# EAGLE design SC01 ProtoBoard V0.1 (EAGLE 9.6.2)

## Sheet 1 of 2
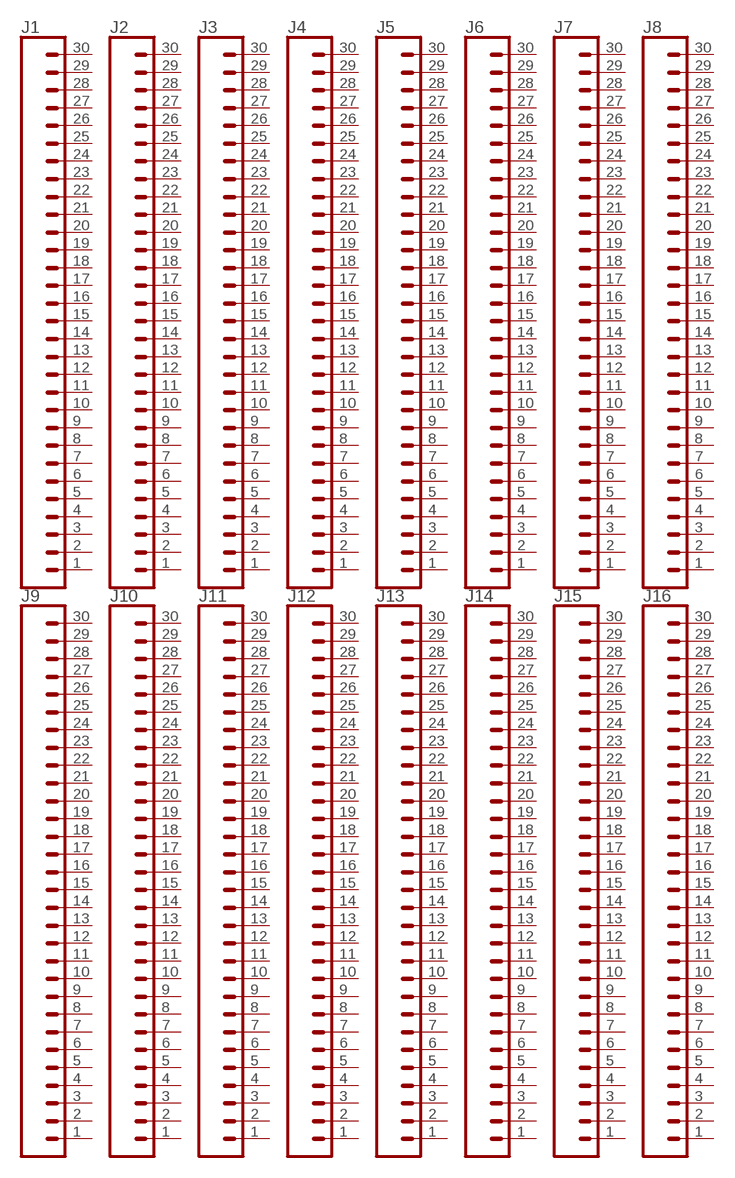
[diagram p0: schematic, sheet 1]

### Parts
J1  CONN_30NO_SILK  [1X30_NO_SILK]
J2  CONN_30NO_SILK  [1X30_NO_SILK]
J3  CONN_30NO_SILK  [1X30_NO_SILK]
J4  CONN_30NO_SILK  [1X30_NO_SILK]
J5  CONN_30NO_SILK  [1X30_NO_SILK]
J6  CONN_30NO_SILK  [1X30_NO_SILK]
J7  CONN_30NO_SILK  [1X30_NO_SILK]
J8  CONN_30NO_SILK  [1X30_NO_SILK]
J9  CONN_30NO_SILK  [1X30_NO_SILK]
J10  CONN_30NO_SILK  [1X30_NO_SILK]
J11  CONN_30NO_SILK  [1X30_NO_SILK]
J12  CONN_30NO_SILK  [1X30_NO_SILK]
J13  CONN_30NO_SILK  [1X30_NO_SILK]
J14  CONN_30NO_SILK  [1X30_NO_SILK]
J15  CONN_30NO_SILK  [1X30_NO_SILK]
J16  CONN_30NO_SILK  [1X30_NO_SILK]
Unconnected: J1.1 J1.2 J1.3 J1.4 J1.5 J1.6 J1.7 J1.8 J1.9 J1.10 J1.11 J1.12 J1.13 J1.14 J1.15 J1.16 J1.17 J1.18 J1.19 J1.20 J1.21 J1.22 J1.23 J1.24 J1.25 J1.26 J1.27 J1.28 J1.29 J1.30 J2.1 J2.2 J2.3 J2.4 J2.5 J2.6 J2.7 J2.8 J2.9 J2.10 J2.11 J2.12 J2.13 J2.14 J2.15 J2.16 J2.17 J2.18 J2.19 J2.20 J2.21 J2.22 J2.23 J2.24 J2.25 J2.26 J2.27 J2.28 J2.29 J2.30 J3.1 J3.2 J3.3 J3.4 J3.5 J3.6 J3.7 J3.8 J3.9 J3.10 J3.11 J3.12 J3.13 J3.14 J3.15 J3.16 J3.17 J3.18 J3.19 J3.20 J3.21 J3.22 J3.23 J3.24 J3.25 J3.26 J3.27 J3.28 J3.29 J3.30 J4.1 J4.2 J4.3 J4.4 J4.5 J4.6 J4.7 J4.8 J4.9 J4.10 J4.11 J4.12 J4.13 J4.14 J4.15 J4.16 J4.17 J4.18 J4.19 J4.20 J4.21 J4.22 J4.23 J4.24 J4.25 J4.26 J4.27 J4.28 J4.29 J4.30 J5.1 J5.2 J5.3 J5.4 J5.5 J5.6 J5.7 J5.8 J5.9 J5.10 J5.11 J5.12 J5.13 J5.14 J5.15 J5.16 J5.17 J5.18 J5.19 J5.20 J5.21 J5.22 J5.23 J5.24 J5.25 J5.26 J5.27 J5.28 J5.29 J5.30 J6.1 J6.2 J6.3 J6.4 J6.5 J6.6 J6.7 J6.8 J6.9 J6.10 J6.11 J6.12 J6.13 J6.14 J6.15 J6.16 J6.17 J6.18 J6.19 J6.20 J6.21 J6.22 J6.23 J6.24 J6.25 J6.26 J6.27 J6.28 J6.29 J6.30 J7.1 J7.2 J7.3 J7.4 J7.5 J7.6 J7.7 J7.8 J7.9 J7.10 J7.11 J7.12 J7.13 J7.14 J7.15 J7.16 J7.17 J7.18 J7.19 J7.20 J7.21 J7.22 J7.23 J7.24 J7.25 J7.26 J7.27 J7.28 J7.29 J7.30 J8.1 J8.2 J8.3 J8.4 J8.5 J8.6 J8.7 J8.8 J8.9 J8.10 J8.11 J8.12 J8.13 J8.14 J8.15 J8.16 J8.17 J8.18 J8.19 J8.20 J8.21 J8.22 J8.23 J8.24 J8.25 J8.26 J8.27 J8.28 J8.29 J8.30 J9.1 J9.2 J9.3 J9.4 J9.5 J9.6 J9.7 J9.8 J9.9 J9.10 J9.11 J9.12 J9.13 J9.14 J9.15 J9.16 J9.17 J9.18 J9.19 J9.20 J9.21 J9.22 J9.23 J9.24 J9.25 J9.26 J9.27 J9.28 J9.29 J9.30 J10.1 J10.2 J10.3 J10.4 J10.5 J10.6 J10.7 J10.8 J10.9 J10.10 J10.11 J10.12 J10.13 J10.14 J10.15 J10.16 J10.17 J10.18 J10.19 J10.20 J10.21 J10.22 J10.23 J10.24 J10.25 J10.26 J10.27 J10.28 J10.29 J10.30 J11.1 J11.2 J11.3 J11.4 J11.5 J11.6 J11.7 J11.8 J11.9 J11.10 J11.11 J11.12 J11.13 J11.14 J11.15 J11.16 J11.17 J11.18 J11.19 J11.20 J11.21 J11.22 J11.23 J11.24 J11.25 J11.26 J11.27 J11.28 J11.29 J11.30 J12.1 J12.2 J12.3 J12.4 J12.5 J12.6 J12.7 J12.8 J12.9 J12.10 J12.11 J12.12 J12.13 J12.14 J12.15 J12.16 J12.17 J12.18 J12.19 J12.20 J12.21 J12.22 J12.23 J12.24 J12.25 J12.26 J12.27 J12.28 J12.29 J12.30 J13.1 J13.2 J13.3 J13.4 J13.5 J13.6 J13.7 J13.8 J13.9 J13.10 J13.11 J13.12 J13.13 J13.14 J13.15 J13.16 J13.17 J13.18 J13.19 J13.20 J13.21 J13.22 J13.23 J13.24 J13.25 J13.26 J13.27 J13.28 J13.29 J13.30 J14.1 J14.2 J14.3 J14.4 J14.5 J14.6 J14.7 J14.8 J14.9 J14.10 J14.11 J14.12 J14.13 J14.14 J14.15 J14.16 J14.17 J14.18 J14.19 J14.20 J14.21 J14.22 J14.23 J14.24 J14.25 J14.26 J14.27 J14.28 J14.29 J14.30 J15.1 J15.2 J15.3 J15.4 J15.5 J15.6 J15.7 J15.8 J15.9 J15.10 J15.11 J15.12 J15.13 J15.14 J15.15 J15.16 J15.17 J15.18 J15.19 J15.20 J15.21 J15.22 J15.23 J15.24 J15.25 J15.26 J15.27 J15.28 J15.29 J15.30 J16.1 J16.2 J16.3 J16.4 J16.5 J16.6 J16.7 J16.8 J16.9 J16.10 J16.11 J16.12 J16.13 J16.14 J16.15 J16.16 J16.17 J16.18 J16.19 J16.20 J16.21 J16.22 J16.23 J16.24 J16.25 J16.26 J16.27 J16.28 J16.29 J16.30

## Sheet 2 of 2
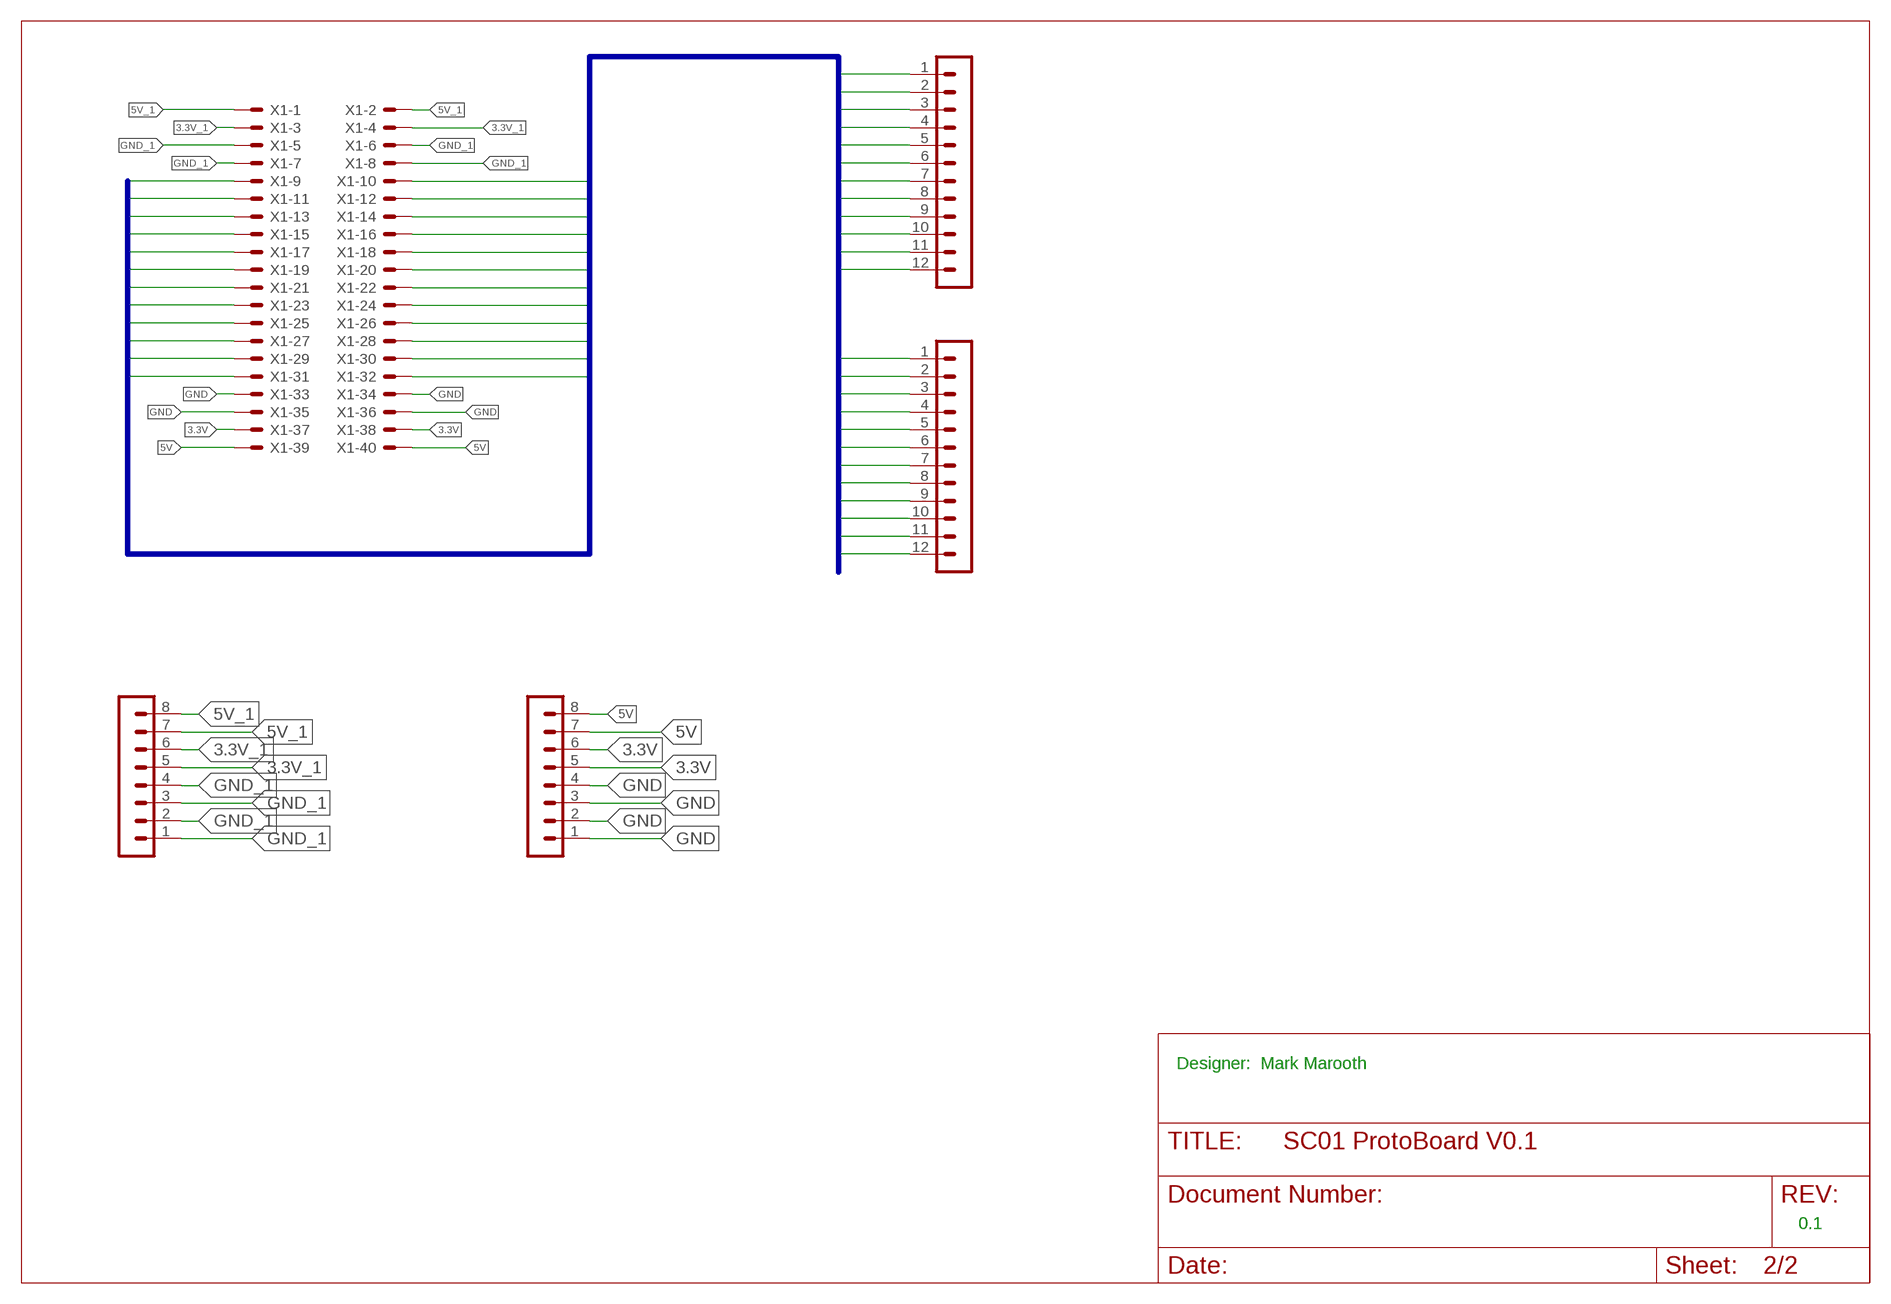
[diagram p1: schematic, sheet 2]

### Parts
HDR1  MA12-1  [MA12-1]
HDR2  MA12-1  [MA12-1]
HDR3  MA08-1  [MA08-1]
HDR4  MA08-1  [MA08-1]
X1  87758-4016  [87758-4016]

### Nets
3.3V: HDR4.5 HDR4.6 X1.37 X1.38
3.3V_1: HDR3.5 HDR3.6 X1.3 X1.4
5V: HDR4.7 HDR4.8 X1.39 X1.40
5V_1: HDR3.7 HDR3.8 X1.1 X1.2
GND: HDR4.1 HDR4.2 HDR4.3 HDR4.4 X1.33 X1.34 X1.35 X1.36
GND_1: HDR3.1 HDR3.2 HDR3.3 HDR3.4 X1.5 X1.6 X1.7 X1.8
PHEADER9: HDR1.1 X1.9
PHEADER10: HDR1.2 X1.10
PHEADER11: HDR1.3 X1.11
PHEADER12: HDR1.4 X1.12
PHEADER13: HDR1.5 X1.13
PHEADER14: HDR1.6 X1.14
PHEADER15: HDR1.7 X1.15
PHEADER16: HDR1.8 X1.16
PHEADER17: HDR1.9 X1.17
PHEADER18: HDR1.10 X1.18
PHEADER19: HDR1.11 X1.19
PHEADER20: HDR1.12 X1.20
PHEADER21: HDR2.1 X1.21
PHEADER22: HDR2.2 X1.22
PHEADER23: HDR2.3 X1.23
PHEADER24: HDR2.4 X1.24
PHEADER25: HDR2.5 X1.25
PHEADER26: HDR2.6 X1.26
PHEADER27: HDR2.7 X1.27
PHEADER28: HDR2.8 X1.28
PHEADER29: HDR2.9 X1.29
PHEADER30: HDR2.10 X1.30
PHEADER31: HDR2.11 X1.31
PHEADER32: HDR2.12 X1.32

### Buses
PHEADER[1..40]

### Notes on the sheet
- Designer:  Mark Marooth
- 0.1

## Library data of the parts
HDR1 HDR2 = con-lstb:MA12-1: PIN HEADER; OC_FARNELL: unknown; OC_NEWARK: unknown
HDR3 HDR4 = con-lstb:MA08-1: PIN HEADER; OC_FARNELL: unknown; OC_NEWARK: unknown
J1-J16 = SparkFun-Connectors:CONN_30: Multi connection point. Often used as Generic Header-pin footprint for 0.1 inch spaced/style header connections On any of the 0.1 inch spaced packages, you can populate with these: Break Away Headers - Straight <https://www.sparkfun.com/products/116> (PRT-00116) Break Away Male Headers - Right Angle <https://www.sparkfun.com/products/553> (PRT-00553) Female Headers <https://www.sparkfun.com/products/115> (PRT-00115) Break Away Headers - Machine Pin <https://www.sparkfun.com/products/117> (PRT-00117) Break Away Female Headers - Swiss Machine Pin <https://www.sparkfun.com/products/743> (PRT-00743) For SCREWTERMINALS and SPRING TERMINALS visit here: Screw Terimnals on SparkFun.com <https://www.sparkfun.com/search/results?term=Screw+Terminals> (5mm/3.5mm/2.54mm spacing) This device is also useful as a general connection point to wire up your design to another part of your project. Our various solder wires solder well into these plated through hole pads. Hook-Up Wire - Assortment (Stranded, 22 AWG) <https://www.sparkfun.com/products/11375> (PRT-11375) Hook-Up Wire - Assortment (Solid Core, 22 AWG) <https://www.sparkfun.com/products/11367> (PRT-11367) View the entire wire category on our website here <https://www.sparkfun.com/categories/141> Special notes: Molex polarized connector foot print use with SKU : PRT-08231 with associated crimp pins and housings. 1MM SMD Version SKU: PRT-10208 NOTES ON THE VARIANTS LOCK and LOCK_LONGPADS... This footprint was designed to help hold the alignment of a through-hole component (i.e. 6-pin header) while soldering it into place. You may notice that each hole has been shifted either up or down by 0.005 of an inch from it's more standard position (which is a perfectly straight line). This slight alteration caused the pins (the squares in the middle) to touch the edges of the holes. Because they are alternating, it causes a "brace" to hold the component in place. 0.005 has proven to be the perfect amount of "off-center" position when using our standard breakaway headers. Although looks a little odd when you look at the bare footprint, once you have a header in there, the alteration is very hard to notice. Also,if you push a header all the way into place, it is covered up entirely on the bottom side.
X1 = con-molex:87758-4016: 40 Pin - 2mm Dual Row Single Wafer, Vertical T/H HDR Source: http://www.molex.com/pdm_docs/sd/877580616_sd.pdf; MPN: 87758-4016; OC_FARNELL: unknown; OC_NEWARK: 25M5691

## Board
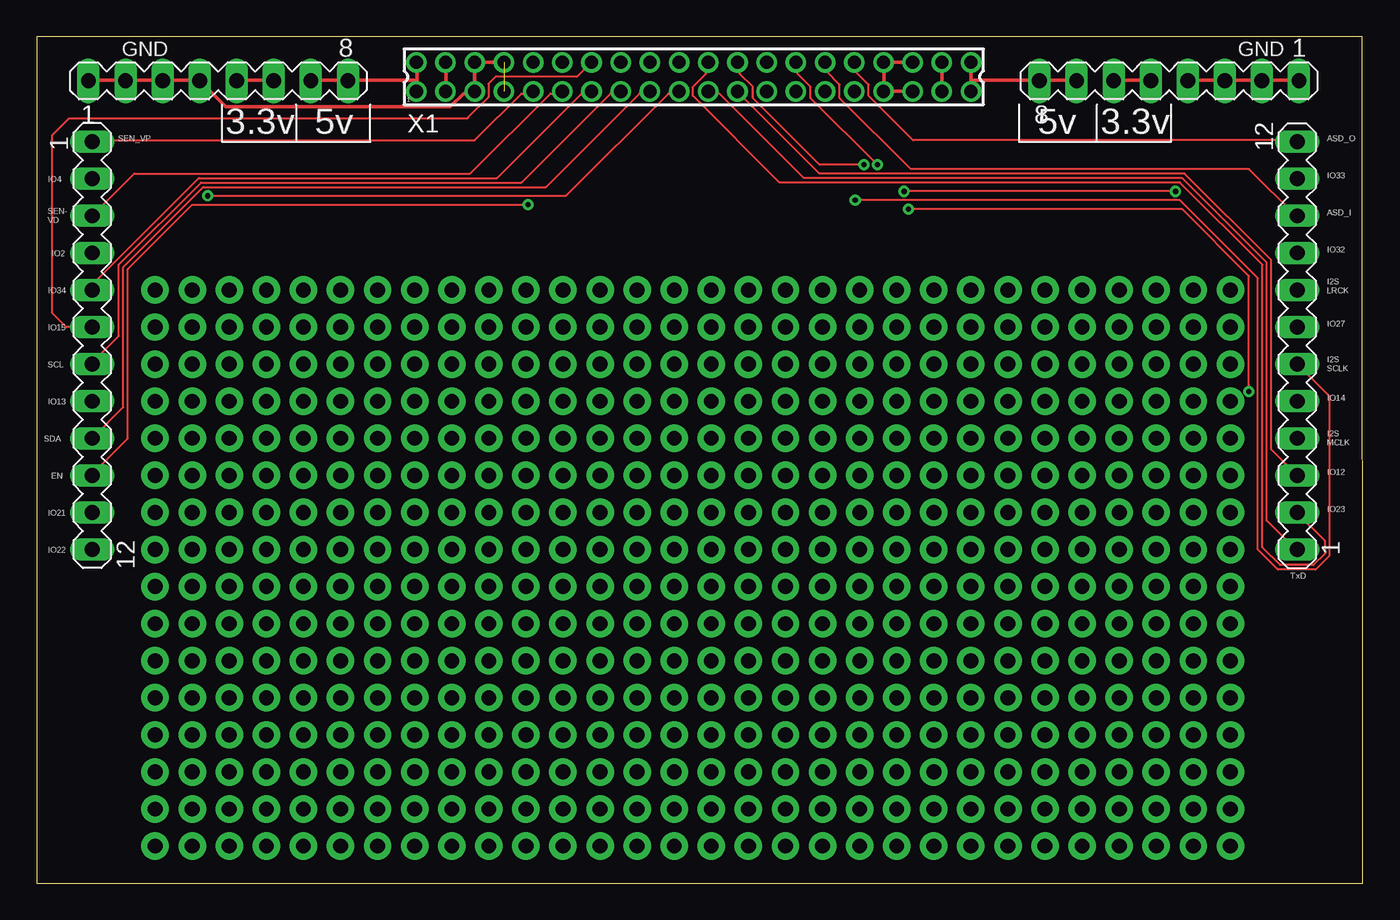
[diagram p2: board, top side]
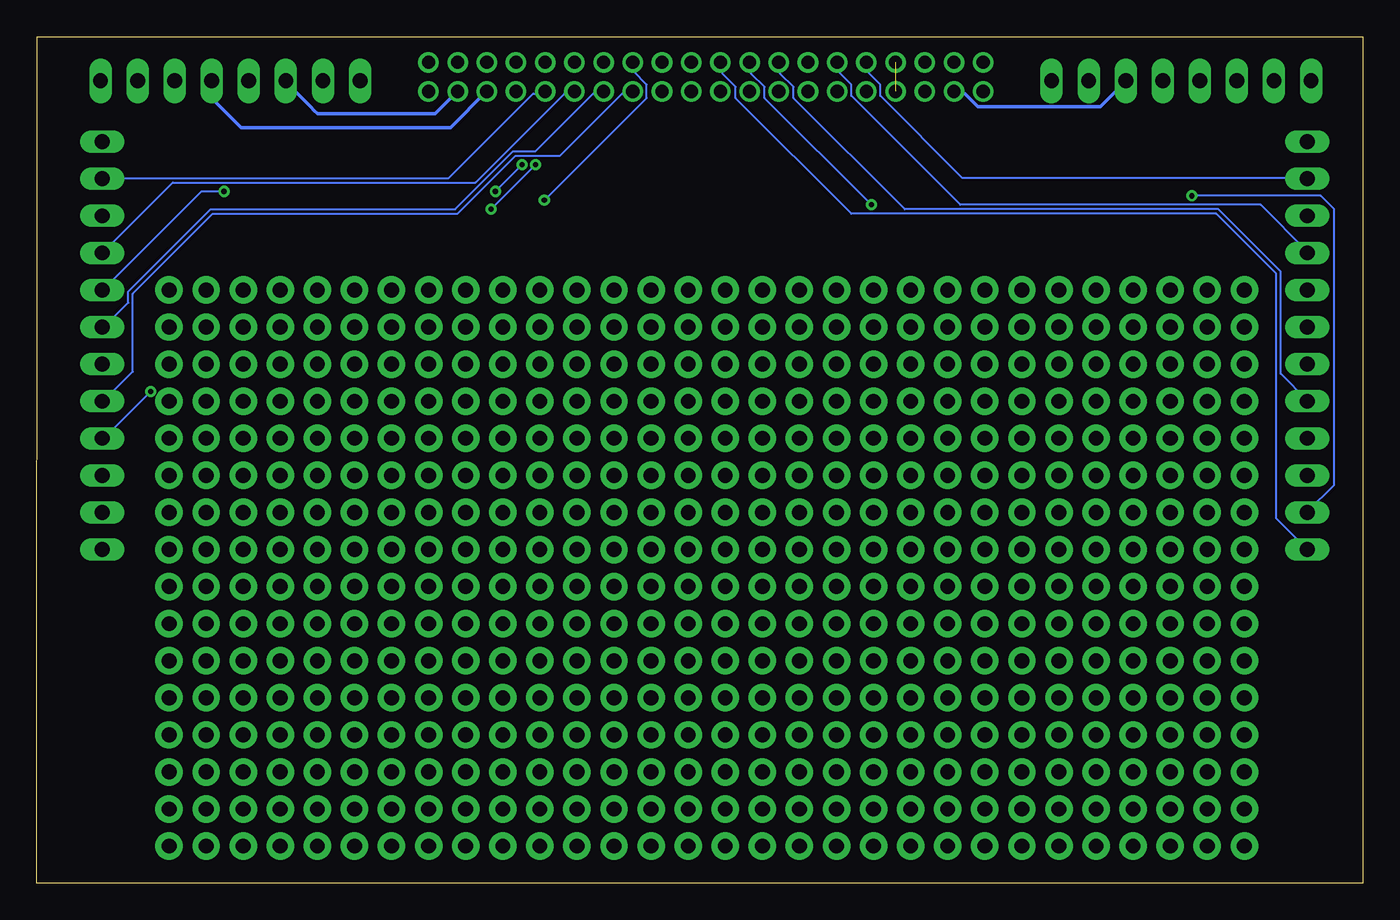
[diagram p3: board, bottom side, seen from below]

Size 90.87 x 58.01 mm. Coordinates in mm from the lower left corner, seen from the top.
Outline: 0,0 90.87,0 90.81,58.01 0,58.01 0,0
Copper layers (1*16): Top 0.035mm / dielectric 1.5mm / Bottom 0.035mm
Design rules "default": minimum track width 6mil, minimum drill 0.35mm, track to track 6mil, track to pad 6mil, pad to pad 6mil, via to via 6mil, smd to smd 6mil, copper to edge 40mil, drill to drill 6mil, minimum pad ring 10mil, minimum via ring 8mil, stop-mask expansion 4mil, vias tented up to drill 0mil, thermal gap 10mil

### Footprints (pad centres in the part's own frame; a part is rotated, then mirrored left to right if it is on the bottom)
MA12-1 = drill 1.016 long: 1 -13.97,0; 2 -11.43,0; 3 -8.89,0; 4 -6.35,0; 5 -3.81,0; 6 -1.27,0; 7 1.27,0; 8 3.81,0; 9 6.35,0; 10 8.89,0; 11 11.43,0; 12 13.97,0
MA08-1 = drill 1.016 long: 1 -8.89,0; 2 -6.35,0; 3 -3.81,0; 4 -1.27,0; 5 1.27,0; 6 3.81,0; 7 6.35,0; 8 8.89,0
1X30_NO_SILK = drill 1.016 pad 1.88: 1 0,0; 2 2.54,0; 3 5.08,0; 4 7.62,0; 5 10.16,0; 6 12.7,0; 7 15.24,0; 8 17.78,0; 9 20.32,0; 10 22.86,0; 11 25.4,0; 12 27.94,0; 13 30.48,0; 14 33.02,0; 15 35.56,0; 16 38.1,0; 17 40.64,0; 18 43.18,0; 19 45.72,0; 20 48.26,0; 21 50.8,0; 22 53.34,0; 23 55.88,0; 24 58.42,0; 25 60.96,0; 26 63.5,0; 27 66.04,0; 28 68.58,0; 29 71.12,0; 30 73.66,0
87758-4016 = drill 0.9 pad 1.27: 1 -19,-1; 2 -19,1; 3 -17,-1; 4 -17,1; 5 -15,-1; 6 -15,1; 7 -13,-1; 8 -13,1; 9 -11,-1; 10 -11,1; 11 -9,-1; 12 -9,1; 13 -7,-1; 14 -7,1; 15 -5,-1; 16 -5,1; 17 -3,-1; 18 -3,1; 19 -1,-1; 20 -1,1; 21 1,-1; 22 1,1; 23 3,-1; 24 3,1; 25 5,-1; 26 5,1; 27 7,-1; 28 7,1; 29 9,-1; 30 9,1; 31 11,-1; 32 11,1; 33 13,-1; 34 13,1; 35 15,-1; 36 15,1; 37 17,-1; 38 17,1; 39 19,-1; 40 19,1

### Placement (x,y rotation side)
HDR1  3.81,36.83 270 top
HDR2  86.36,36.83 90 top
HDR3  12.45,54.97 0 top
HDR4  77.6,54.97 180 top
J1  8.13,40.64 0 top
J2  8.13,38.1 0 top
J3  8.13,35.56 0 top
J4  8.13,33.02 0 top
J5  8.13,30.48 0 top
J6  8.13,27.94 0 top
J7  8.13,25.4 0 top
J8  8.13,22.86 0 top
J9  8.13,20.32 0 top
J10  8.13,17.78 0 top
J11  8.13,15.24 0 top
J12  8.13,12.7 0 top
J13  8.13,10.16 0 top
J14  8.13,7.62 0 top
J15  8.13,5.08 0 top
J16  8.13,2.54 0 top
X1  45.02,55.24 0 top

### Tracks (layer width: path | path; a pad name or v marks a point on that pad's centre or on a via)
3.3V
  Top 0.152: 62.03,54.25 X1.37 | X1.38 | 73.91,55.02 HDR4.6 | 76.2,55.02 HDR4.5
  Top 0.254: X1.38 62.03,54.25 | 76.2,55.02 73.91,55.02
  Bottom 0.254: HDR4.6 73.76,54.86 72.08,53.19 71.84,52.94 71.6,52.7 63.56,52.7 X1.37
3.3V_1
  Top 0.152: 28.04,54.25 X1.3 | 28.04,56.24 X1.4 | 13.72,55.02 HDR3.5 | 16.15,55.02 HDR3.6
  Top 0.254: 28.04,56.24 28.04,54.25 | 16.15,55.02 13.72,55.02
  Bottom 0.152: 16.31,54.86 HDR3.6
  Bottom 0.254: 16.31,54.86 17.98,53.19 26.36,53.19 27.28,54.1 27.89,54.1 X1.3
5V
  Top 0.152: 64.01,54.25 X1.39 | 64.01,56.24 X1.40 | 68.73,55.02 HDR4.8 68.58,55.02 | 71.17,55.02 HDR4.7
  Top 0.254: 64.01,56.24 64.01,55.02 | 64.01,55.02 64.01,54.25 | 71.17,55.02 68.73,55.02 | 68.58,55.02 64.01,55.02
5V_1
  Top 0.152: 26.06,54.25 X1.1 | 26.06,56.24 X1.2 | 18.9,55.02 HDR3.7 | 21.34,55.02 HDR3.8
  Top 0.254: 26.06,56.24 26.06,55.02 | 26.06,55.02 26.06,54.25 | 18.9,55.02 21.34,55.02 26.06,55.02
GND
  Top 0.152: 59.89,54.25 X1.35 | 58.06,56.24 X1.34 | 58.06,54.25 X1.33 | 78.94,55.02 HDR4.4 78.79,54.86 | 81.38,55.02 HDR4.3 81.53,55.02 | 83.82,55.02 HDR4.2 83.97,55.02 | 86.41,55.02 HDR4.1
  Top 0.254: 59.89,54.25 58.06,54.25 58.06,56.24 59.89,56.24 X1.36 | 81.38,55.02 78.94,55.02 | 81.53,55.02 83.82,55.02 | 83.97,55.02 86.41,55.02 | 60.05,54.1 X1.35
  Bottom 0.254: X1.35 62.51,51.75 76.83,51.75 78.87,53.78 HDR4.4
GND_1  (1 unrouted)
  Top 0.152: 30.02,54.25 X1.5 29.87,54.1 | 32,56.24 X1.8 | X1.6 | 3.66,55.02 HDR3.1 | 8.69,55.02 HDR3.3 8.53,55.02 | 11.12,55.02 HDR3.4 11.28,54.86 | 6.1,55.02 HDR3.2
  Top 0.254: 30.02,54.25 X1.6 32,56.24 | 3.66,55.02 6.1,55.02 8.53,55.02 | 11.12,55.02 8.69,55.02 | 29.87,54.1 29.26,54.1 28.35,53.19 12.95,53.19 11.28,54.86
PHEADER9
  Top 0.152: X1.9 33.98,54.1 33.22,54.1 30.02,50.9 3.81,50.9 HDR1.1
PHEADER10
  Bottom 0.152: X1.10 33.98,56.24 33.98,55.63 33.07,54.71 33.07,53.95 27.43,48.31 3.81,48.31 HDR1.2
PHEADER11
  Top 0.152: HDR1.3 6.71,48.62 29.72,48.62 35.2,54.1 35.97,54.1 X1.11
PHEADER12
  Bottom 0.152: X1.12 35.97,56.24 35.97,55.63 35.05,54.71 35.05,53.95 27.58,46.48 7.01,46.48 3.81,43.28 HDR1.4
PHEADER13
  Top 0.152: HDR1.5 3.81,41 11.12,48.31 31.55,48.31 37.34,54.1 37.95,54.1 X1.13
PHEADER14
  Top 0.152: X1.14 37.02,55.24 31.43,55.24 30.95,54.77 30.95,53.86 29.53,52.43 29.53,52.39 2.22,52.39 1.09,51.26 1.09,39.05 2.04,38.1 HDR1.6
PHEADER15
  Top 0.152: X1.15 39.93,54.1 39.32,54.1 33.22,48.01 11.28,48.01 5.64,42.37 5.64,37.49 3.81,35.66 HDR1.7
PHEADER16
  Bottom 0.152: X1.16 39.93,56.24 39.93,55.47 39.01,54.56 39.01,53.8 31.39,46.18 9.91,46.18 5.64,41.91 5.64,34.9 3.81,33.07 HDR1.8
PHEADER17
  Top 0.152: HDR1.9 5.94,32.61 5.94,42.22 11.43,47.7 34.9,47.7 41.3,54.1 41.91,54.1 X1.17
PHEADER18  (via drill 0.35)
  Top 0.152: v33.68,46.48 10.67,46.48 6.25,42.06 6.25,30.48 3.81,28.04 HDR1.10
  Bottom 0.152: v33.68,46.48 41,53.8 41,54.56 41.91,55.47 41.91,56.24 X1.18
PHEADER19  (via drill 0.35)
  Top 0.152: v11.73,47.09 36.27,47.09 43.28,54.1 43.89,54.1 X1.19
  Bottom 0.152: v11.73,47.09 2.9,47.09 1.98,46.18 1.98,27.28 3.81,25.45 HDR1.11
PHEADER20
  Bottom 0.152: HDR1.12 5.94,24.99 5.94,41.76 10.06,45.87 35.05,45.87 42.98,53.8 42.98,54.56 43.89,55.47 43.89,56.24 X1.20
PHEADER21
  Top 0.152: X1.21 46.02,54.1 46.79,54.1 52.58,48.31 78.49,48.31 84.28,42.52 84.28,24.84 86.26,22.86 HDR2.1
PHEADER22
  Top 0.152: X1.22 45.87,56.24 45.87,55.47 44.96,54.56 44.96,53.95 50.9,48.01 78.33,48.01 83.97,42.37 83.97,23.01 85.19,21.79 87.48,21.79 88.24,22.55 88.24,23.47 86.41,25.3 HDR2.2
PHEADER23
  Top 0.152: HDR2.3 84.58,29.72 84.58,42.67 78.64,48.62 53.65,48.62 48.16,54.1 X1.23
PHEADER24  (via drill 0.35)
  Top 0.152: v56.69,49.23 53.65,49.23 49.07,53.8 49.07,54.56 48.16,55.47 48.16,56.24 X1.24 | v59.74,46.18 78.49,46.18 83.06,41.6 v83.06,33.68
  Bottom 0.152: v59.74,46.18 v56.69,49.23 | v83.06,33.68 86.26,30.48 HDR2.4
PHEADER25
  Bottom 0.152: X1.25 50.14,54.1 50.75,54.1 55.02,49.84 58.06,49.84 62.03,45.87 78.79,45.87 84.28,40.39 84.28,35.05 86.26,33.07 HDR2.5
PHEADER26  (via drill 0.35)
  Top 0.152: v56.08,46.79 78.33,46.79 83.67,41.45 83.67,22.86 85.04,21.49 87.63,21.49 88.54,22.4 88.54,33.38 HDR2.6
  Bottom 0.152: v56.08,46.79 49.07,53.8 49.07,54.71 49.99,55.63 49.99,56.24 X1.26
PHEADER27
  Bottom 0.152: X1.27 52.12,54.1 52.73,54.1 56.69,50.14 58.22,50.14 62.18,46.18 78.94,46.18 84.58,40.54 84.58,39.78 86.26,38.1 HDR2.7
PHEADER28  (via drill 0.35)
  Top 0.152: v57.61,49.23 53.03,53.8 53.03,54.56 52.12,55.47 52.12,56.24 X1.28 | v78.03,47.4 v59.44,47.4
  Bottom 0.152: v59.44,47.4 v57.61,49.23 | v78.03,47.4 79.55,47.4 86.26,40.69 HDR2.8
PHEADER29
  Bottom 0.152: HDR2.9 81.53,48.01 60.81,48.01 54.71,54.1 54.1,54.1 X1.29
PHEADER30
  Top 0.152: X1.30 54.1,56.24 54.1,55.63 55.02,54.71 55.02,53.8 59.89,48.92 83.06,48.92 86.26,45.72 HDR2.10
PHEADER31
  Bottom 0.152: X1.31 56.08,54.1 56.84,54.1 62.64,48.31 86.26,48.31 HDR2.11
PHEADER32
  Top 0.152: X1.32 56.08,56.24 56.08,55.63 57,54.71 57,53.95 60.05,50.9 86.26,50.9 HDR2.12

### Text on the board
tPlace: GND | GND | SEN_VP | 3.3v | 5v | 5v | 3.3v | ASD_O | IO4 | IO33 | ASD_I | SEN- / VD | IO2 | IO32 | IO34 | I2S / LRCK | IO15 | IO27 | SCL | I2S / SCLK | IO13 | IO14 | SDA | I2S / MCLK | EN | IO12 | IO21 | IO23 | IO22 | TxD